# EAGLE design G209B (EAGLE 6.6.0)
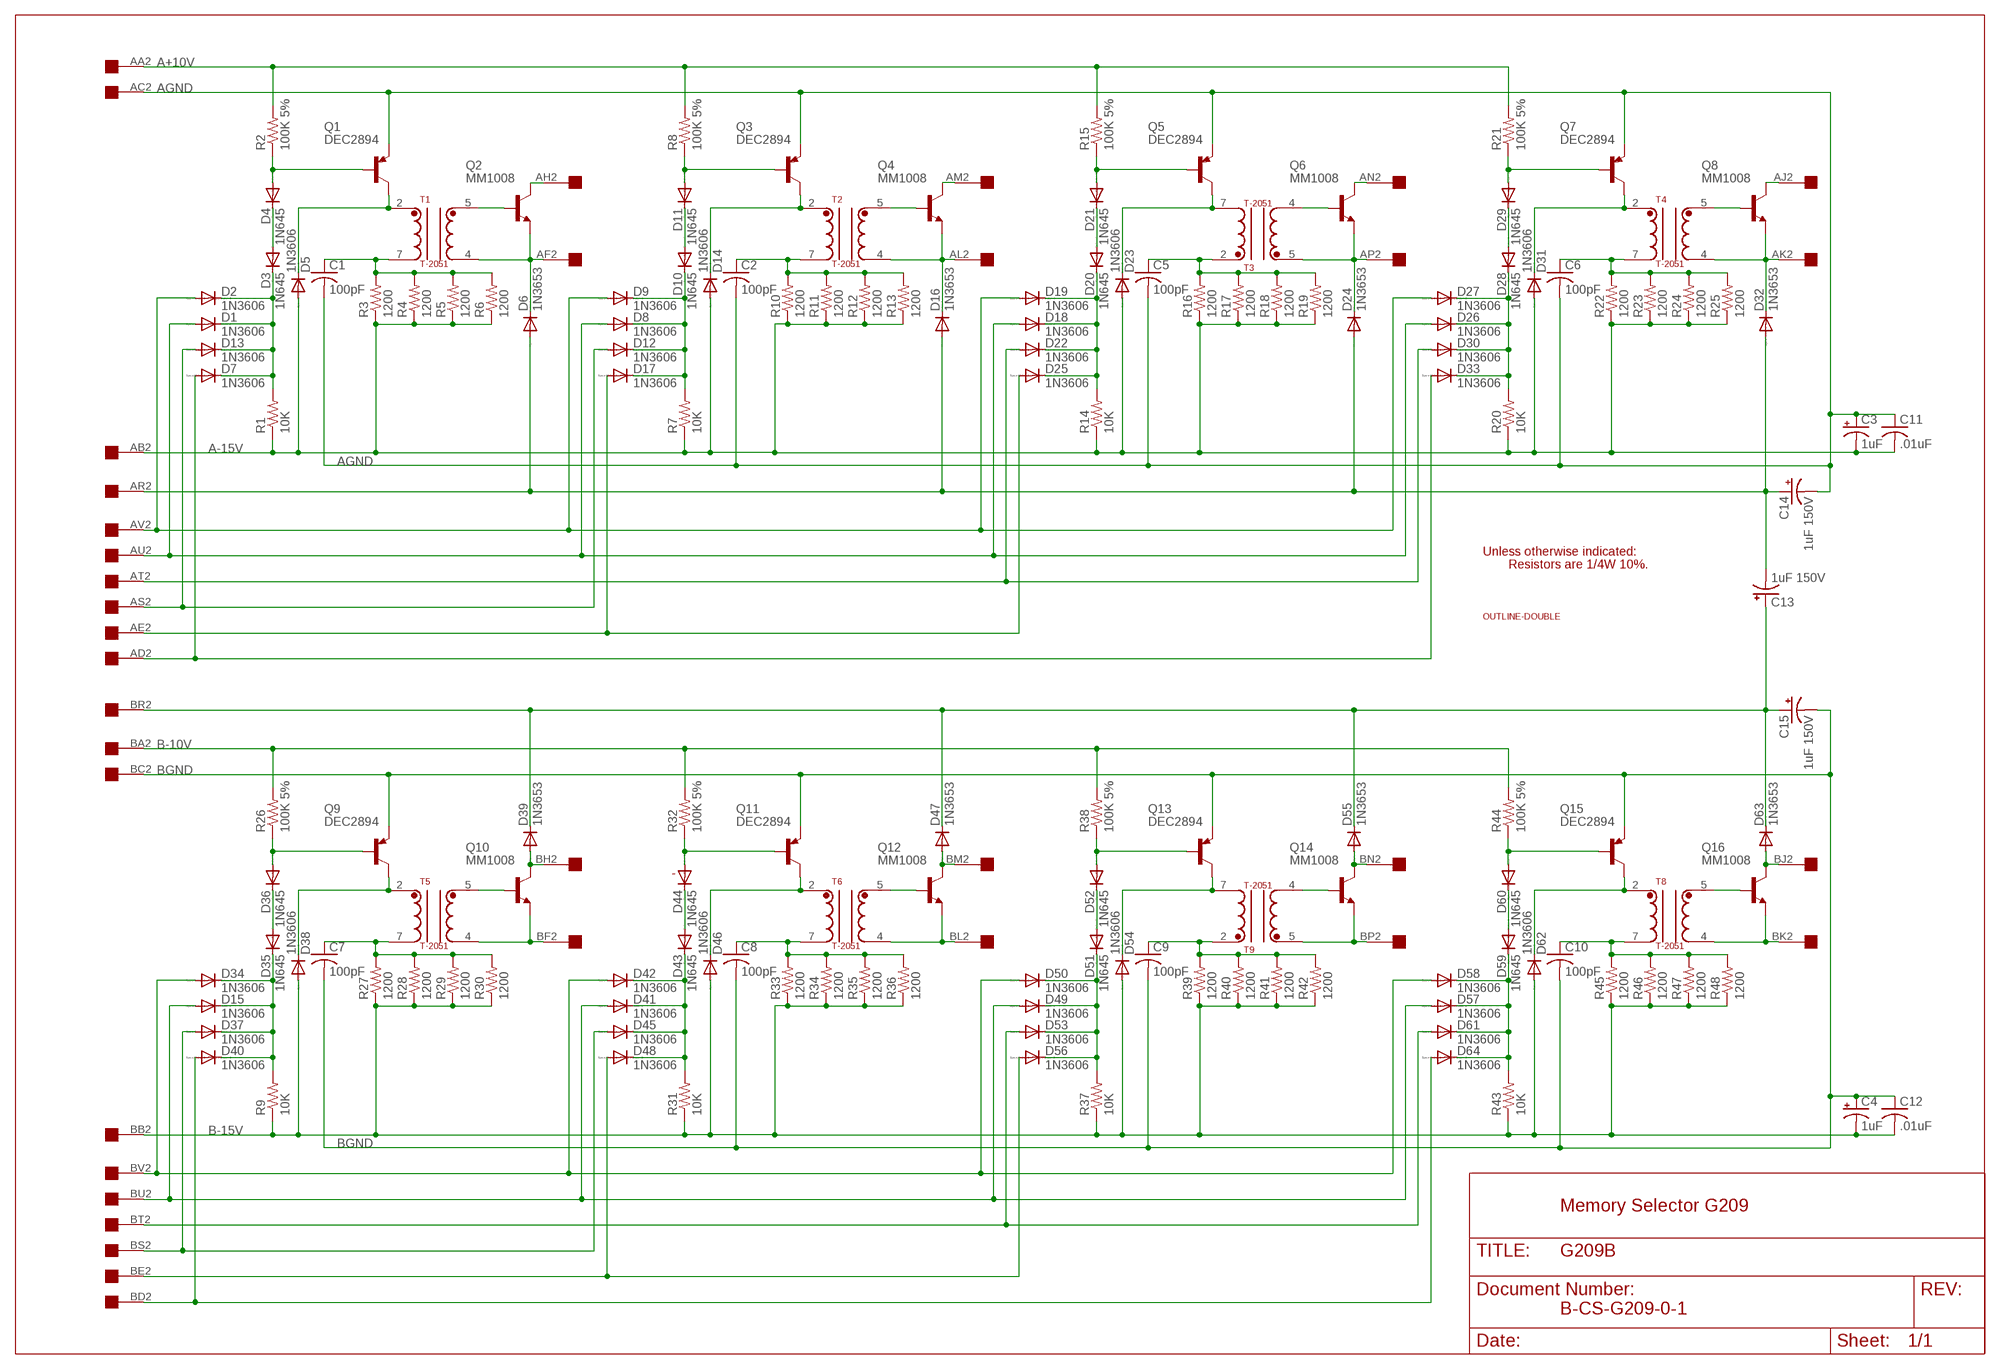
[diagram p0: schematic, sheet 1]

## Parts
C1  100pF  C-US075-032X103  [C075-032X103]
C2  100pF  C-US075-032X103  [C075-032X103]
C3  1uF  CPOL-USE12-4AXIAL  [E12-4]
C4  1uF  CPOL-USE12-4AXIAL  [E12-4]
C5  100pF  C-US075-032X103  [C075-032X103]
C6  100pF  C-US075-032X103  [C075-032X103]
C7  100pF  C-US075-032X103  [C075-032X103]
C8  100pF  C-US075-032X103  [C075-032X103]
C9  100pF  C-US075-032X103  [C075-032X103]
C10  100pF  C-US075-032X103  [C075-032X103]
C11  .01uF  C-US050-025X075  [C050-025X075]
C12  .01uF  C-US050-025X075  [C050-025X075]
C13  1uF 150V  CPOL-USE25-9AXIAL  [E25-9]
C14  1uF 150V  CPOL-USE25-9AXIAL  [E25-9]
C15  1uF 150V  CPOL-USE25-9AXIAL  [E25-9]
D1  1N3606  1N4148DO35-10  [DO35-10]
D2  1N3606  1N4148DO35-10  [DO35-10]
D3  1N645  1N4148DO35-10  [DO35-10]
D4  1N645  1N4148DO35-10  [DO35-10]
D5  1N3606  1N4148DO35-10  [DO35-10]
D6  1N3653  1N4148DO35-10  [DO35-10]
D7  1N3606  1N4148DO35-10  [DO35-10]
D8  1N3606  1N4148DO35-10  [DO35-10]
D9  1N3606  1N4148DO35-10  [DO35-10]
D10  1N645  1N4148DO35-10  [DO35-10]
D11  1N645  1N4148DO35-10  [DO35-10]
D12  1N3606  1N4148DO35-10  [DO35-10]
D13  1N3606  1N4148DO35-10  [DO35-10]
D14  1N3606  1N4148DO35-10  [DO35-10]
D15  1N3606  1N4148DO35-10  [DO35-10]
D16  1N3653  1N4148DO35-10  [DO35-10]
D17  1N3606  1N4148DO35-10  [DO35-10]
D18  1N3606  1N4148DO35-10  [DO35-10]
D19  1N3606  1N4148DO35-10  [DO35-10]
D20  1N645  1N4148DO35-10  [DO35-10]
D21  1N645  1N4148DO35-10  [DO35-10]
D22  1N3606  1N4148DO35-10  [DO35-10]
D23  1N3606  1N4148DO35-10  [DO35-10]
D24  1N3653  1N4148DO35-10  [DO35-10]
D25  1N3606  1N4148DO35-10  [DO35-10]
D26  1N3606  1N4148DO35-10  [DO35-10]
D27  1N3606  1N4148DO35-10  [DO35-10]
D28  1N645  1N4148DO35-10  [DO35-10]
D29  1N645  1N4148DO35-10  [DO35-10]
D30  1N3606  1N4148DO35-10  [DO35-10]
D31  1N3606  1N4148DO35-10  [DO35-10]
D32  1N3653  1N4148DO35-10  [DO35-10]
D33  1N3606  1N4148DO35-10  [DO35-10]
D34  1N3606  1N4148DO35-10  [DO35-10]
D35  1N645  1N4148DO35-10  [DO35-10]
D36  1N645  1N4148DO35-10  [DO35-10]
D37  1N3606  1N4148DO35-10  [DO35-10]
D38  1N3606  1N4148DO35-10  [DO35-10]
D39  1N3653  1N4148DO35-10  [DO35-10]
D40  1N3606  1N4148DO35-10  [DO35-10]
D41  1N3606  1N4148DO35-10  [DO35-10]
D42  1N3606  1N4148DO35-10  [DO35-10]
D43  1N645  1N4148DO35-10  [DO35-10]
D44  1N645  1N4148DO35-10  [DO35-10]
D45  1N3606  1N4148DO35-10  [DO35-10]
D46  1N3606  1N4148DO35-10  [DO35-10]
D47  1N3653  1N4148DO35-10  [DO35-10]
D48  1N3606  1N4148DO35-10  [DO35-10]
D49  1N3606  1N4148DO35-10  [DO35-10]
D50  1N3606  1N4148DO35-10  [DO35-10]
D51  1N645  1N4148DO35-10  [DO35-10]
D52  1N645  1N4148DO35-10  [DO35-10]
D53  1N3606  1N4148DO35-10  [DO35-10]
D54  1N3606  1N4148DO35-10  [DO35-10]
D55  1N3653  1N4148DO35-10  [DO35-10]
D56  1N3606  1N4148DO35-10  [DO35-10]
D57  1N3606  1N4148DO35-10  [DO35-10]
D58  1N3606  1N4148DO35-10  [DO35-10]
D59  1N645  1N4148DO35-10  [DO35-10]
D60  1N645  1N4148DO35-10  [DO35-10]
D61  1N3606  1N4148DO35-10  [DO35-10]
D62  1N3606  1N4148DO35-10  [DO35-10]
D63  1N3653  1N4148DO35-10  [DO35-10]
D64  1N3606  1N4148DO35-10  [DO35-10]
Q1  DEC2894  2N2904  [TO39]
Q2  MM1008  2N2102  [TO5]
Q3  DEC2894  2N2904  [TO39]
Q4  MM1008  2N2102  [TO5]
Q5  DEC2894  2N2904  [TO39]
Q6  MM1008  2N2102  [TO5]
Q7  DEC2894  2N2904  [TO39]
Q8  MM1008  2N2102  [TO5]
Q9  DEC2894  2N2904  [TO39]
Q10  MM1008  2N2102  [TO5]
Q11  DEC2894  2N2904  [TO39]
Q12  MM1008  2N2102  [TO5]
Q13  DEC2894  2N2904  [TO39]
Q14  MM1008  2N2102  [TO5]
Q15  DEC2894  2N2904  [TO39]
Q16  MM1008  2N2102  [TO5]
R1  10K  R-US_0207/10  [0207/10]
R2  100K 5%  R-US_0207/10  [0207/10]
R3  1200  R-US_0207/10  [0207/10]
R4  1200  R-US_0207/10  [0207/10]
R5  1200  R-US_0207/10  [0207/10]
R6  1200  R-US_0207/10  [0207/10]
R7  10K  R-US_0207/10  [0207/10]
R8  100K 5%  R-US_0207/10  [0207/10]
R9  10K  R-US_0207/10  [0207/10]
R10  1200  R-US_0207/10  [0207/10]
R11  1200  R-US_0207/10  [0207/10]
R12  1200  R-US_0207/10  [0207/10]
R13  1200  R-US_0207/10  [0207/10]
R14  10K  R-US_0207/10  [0207/10]
R15  100K 5%  R-US_0207/10  [0207/10]
R16  1200  R-US_0207/10  [0207/10]
R17  1200  R-US_0207/10  [0207/10]
R18  1200  R-US_0207/10  [0207/10]
R19  1200  R-US_0207/10  [0207/10]
R20  10K  R-US_0207/10  [0207/10]
R21  100K 5%  R-US_0207/10  [0207/10]
R22  1200  R-US_0207/10  [0207/10]
R23  1200  R-US_0207/10  [0207/10]
R24  1200  R-US_0207/10  [0207/10]
R25  1200  R-US_0207/10  [0207/10]
R26  100K 5%  R-US_0207/10  [0207/10]
R27  1200  R-US_0207/10  [0207/10]
R28  1200  R-US_0207/10  [0207/10]
R29  1200  R-US_0207/10  [0207/10]
R30  1200  R-US_0207/10  [0207/10]
R31  10K  R-US_0207/10  [0207/10]
R32  100K 5%  R-US_0207/10  [0207/10]
R33  1200  R-US_0207/10  [0207/10]
R34  1200  R-US_0207/10  [0207/10]
R35  1200  R-US_0207/10  [0207/10]
R36  1200  R-US_0207/10  [0207/10]
R37  10K  R-US_0207/10  [0207/10]
R38  100K 5%  R-US_0207/10  [0207/10]
R39  1200  R-US_0207/10  [0207/10]
R40  1200  R-US_0207/10  [0207/10]
R41  1200  R-US_0207/10  [0207/10]
R42  1200  R-US_0207/10  [0207/10]
R43  10K  R-US_0207/10  [0207/10]
R44  100K 5%  R-US_0207/10  [0207/10]
R45  1200  R-US_0207/10  [0207/10]
R46  1200  R-US_0207/10  [0207/10]
R47  1200  R-US_0207/10  [0207/10]
R48  1200  R-US_0207/10  [0207/10]
T1  T-2051  [TRANSFORMER]
T2  T-2051  [TRANSFORMER]
T3  T-2051  [TRANSFORMER]
T4  T-2051  [TRANSFORMER]
T5  T-2051  [TRANSFORMER]
T6  T-2051  [TRANSFORMER]
T8  T-2051  [TRANSFORMER]
T9  T-2051  [TRANSFORMER]
U$1  DOUBLE  [EDGE-CON4]
U$3  OUTLINE-DOUBLE  [DOUBLE]

## Nets
A+10V [Supply]: R2.2 R8.2 R15.2 R21.2 U$1.AA2
A-15V [Supply]: C3.- C11.2 D5.A D14.A D23.A D31.A R1.1 R3.1 R4.1 R5.1 R6.1 R7.1 R10.1 R11.1 R12.1 R13.1 R14.1 R16.1 R17.1 R18.1 R19.1 R20.1 R22.1 R23.1 R24.1 R25.1 U$1.AB2
AGND [Supply]: C1.2 C2.2 C3.+ C5.2 C6.2 C11.1 C14.- Q1.1(E) Q3.1(E) Q5.1(E) Q7.1(E) U$1.AC2
B-10V [Supply]: R26.2 R32.2 R38.2 R44.2 U$1.BA2
B-15V [Supply]: C4.- C12.2 D38.A D46.A D54.A D62.A R9.1 R27.1 R28.1 R29.1 R30.1 R31.1 R33.1 R34.1 R35.1 R36.1 R37.1 R39.1 R40.1 R41.1 R42.1 R43.1 R45.1 R46.1 R47.1 R48.1 U$1.BB2
BGND [Supply]: C4.+ C7.2 C8.2 C9.2 C10.2 C12.1 C15.- Q9.1(E) Q11.1(E) Q13.1(E) Q15.1(E) U$1.BC2
N$1: D1.C D2.C D3.C D7.C D13.C R1.2
N$2: D3.A D4.C
N$3: D7.A D33.A U$1.AD2
N$4: D12.A D13.A U$1.AS2
N$5: D4.A Q1.2(B) R2.1
N$6: D5.C Q1.3(C) T1.2
N$7: C1.1 R3.2 R4.2 R5.2 R6.2 T1.7
N$8: Q2.2(B) T1.5
N$9: D6.C Q2.1(E) T1.4 U$1.AF2
N$10: D1.A D8.A D18.A D26.A U$1.AU2
N$11: D2.A D9.A D19.A D27.A U$1.AV2
N$12: D8.C D9.C D10.C D12.C D17.C R7.2
N$13: D10.A D11.C
N$14: D11.A Q3.2(B) R8.1
N$15: D14.C Q3.3(C) T2.2
N$16: C2.1 R10.2 R11.2 R12.2 R13.2 T2.7
N$17: Q4.2(B) T2.5
N$18: D16.C Q4.1(E) T2.4 U$1.AL2
N$19: D17.A D25.A U$1.AE2
N$20: D22.A D30.A U$1.AT2
N$21: D15.C D34.C D35.C D37.C D40.C R9.2
N$22: D35.A D36.C
N$23: D18.C D19.C D20.C D22.C D25.C R14.2
N$24: D20.A D21.C
N$25: D21.A Q5.2(B) R15.1
N$26: D23.C Q5.3(C) T3.7
N$27: C5.1 R16.2 R17.2 R18.2 R19.2 T3.2
N$28: Q6.2(B) T3.4
N$29: D24.C Q6.1(E) T3.5 U$1.AP2
N$30: D36.A Q9.2(B) R26.1
N$31: D38.C Q9.3(C) T5.2
N$32: C7.1 R27.2 R28.2 R29.2 R30.2 T5.7
N$33: Q10.2(B) T5.5
N$34: D26.C D27.C D28.C D30.C D33.C R20.2
N$35: D28.A D29.C
N$36: D29.A Q7.2(B) R21.1
N$37: D31.C Q7.3(C) T4.2
N$38: C6.1 R22.2 R23.2 R24.2 R25.2 T4.7
N$39: Q8.2(B) T4.5
N$40: D32.C Q8.1(E) T4.4 U$1.AK2
N$41: Q10.1(E) T5.4 U$1.BF2
N$42: D40.A D64.A U$1.BD2
N$43: D37.A D45.A U$1.BS2
N$44: D15.A D41.A D49.A D57.A U$1.BU2
N$45: Q2.3(C) U$1.AH2
N$49: C13.- C14.+ D6.A D16.A D24.A D32.A U$1.AR2
N$50: Q4.3(C) U$1.AM2
N$51: Q6.3(C) U$1.AN2
N$52: Q8.3(C) U$1.AJ2
N$53: D34.A D42.A D50.A D58.A U$1.BV2
N$54: D41.C D42.C D43.C D45.C D48.C R31.2
N$55: D43.A D44.C
N$56: D44.A Q11.2(B) R32.1
N$57: D46.C Q11.3(C) T6.2
N$58: C8.1 R33.2 R34.2 R35.2 R36.2 T6.7
N$59: Q12.2(B) T6.5
N$60: Q12.1(E) T6.4 U$1.BL2
N$61: D48.A D56.A U$1.BE2
N$62: D49.C D50.C D51.C D53.C D56.C R37.2
N$63: D51.A D52.C
N$64: D52.A Q13.2(B) R38.1
N$65: D54.C Q13.3(C) T9.7
N$66: C9.1 R39.2 R40.2 R41.2 R42.2 T9.2
N$67: Q14.2(B) T9.4
N$68: Q14.1(E) T9.5 U$1.BP2
N$69: D57.C D58.C D59.C D61.C D64.C R43.2
N$70: D59.A D60.C
N$71: D60.A Q15.2(B) R44.1
N$72: D62.C Q15.3(C) T8.2
N$73: C10.1 R45.2 R46.2 R47.2 R48.2 T8.7
N$74: Q16.2(B) T8.5
N$75: Q16.1(E) T8.4 U$1.BK2
N$76: D39.A Q10.3(C) U$1.BH2
N$80: C13.+ C15.+ D39.C D47.C D55.C D63.C U$1.BR2
N$81: D47.A Q12.3(C) U$1.BM2
N$82: D55.A Q14.3(C) U$1.BN2
N$83: D63.A Q16.3(C) U$1.BJ2
N$84: D53.A D61.A U$1.BT2
Unconnected: U$1.AA1 U$1.AB1 U$1.AC1 U$1.AD1 U$1.AE1 U$1.AF1 U$1.AH1 U$1.AJ1 U$1.AK1 U$1.AL1 U$1.AM1 U$1.AN1 U$1.AP1 U$1.AR1 U$1.AS1 U$1.AT1 U$1.AU1 U$1.AV1 U$1.BA1 U$1.BB1 U$1.BC1 U$1.BD1 U$1.BE1 U$1.BF1 U$1.BH1 U$1.BJ1 U$1.BK1 U$1.BL1 U$1.BM1 U$1.BN1 U$1.BP1 U$1.BR1 U$1.BS1 U$1.BT1 U$1.BU1 U$1.BV1

## Notes on the sheet
- Unless otherwise indicated:
- Resistors are 1/4W 10%.
- -
- Memory Selector G209
- B-CS-G209-0-1

## Library data of the parts
C1 C2 C5-C12 = rcl:C-US: CAPACITOR, American symbol
C3 C4 = dec-con:CPOL-USE12-4AXIAL: 0.5" veresion of an electrolytic
C13-C15 = rcl:CPOL-US: POLARIZED CAPACITOR, American symbol
D1-D64 = diode:1N4148: DIODE high speed (Philips)
Q1 Q3 Q5 Q7 Q9 Q11 Q13 Q15 = transistor-pnp:2N2904*: PNP Transistror
Q2 Q4 Q6 Q8 Q10 Q12 Q14 Q16 = transistor:2N2102: NPN TRANSISTOR
R1-R48 = rcl:R-US_: RESISTOR, American symbol
T1-T6 T8 T9 = dec-con:T-2051: T-2052 Transformer
U$1 = dec-con:DOUBLE: Double-Height DEC board
U$3 = dec-con:OUTLINE-*: Board outlines for DEC boards.

## Net classes
1 Supply: width 0.813 mm

## Board
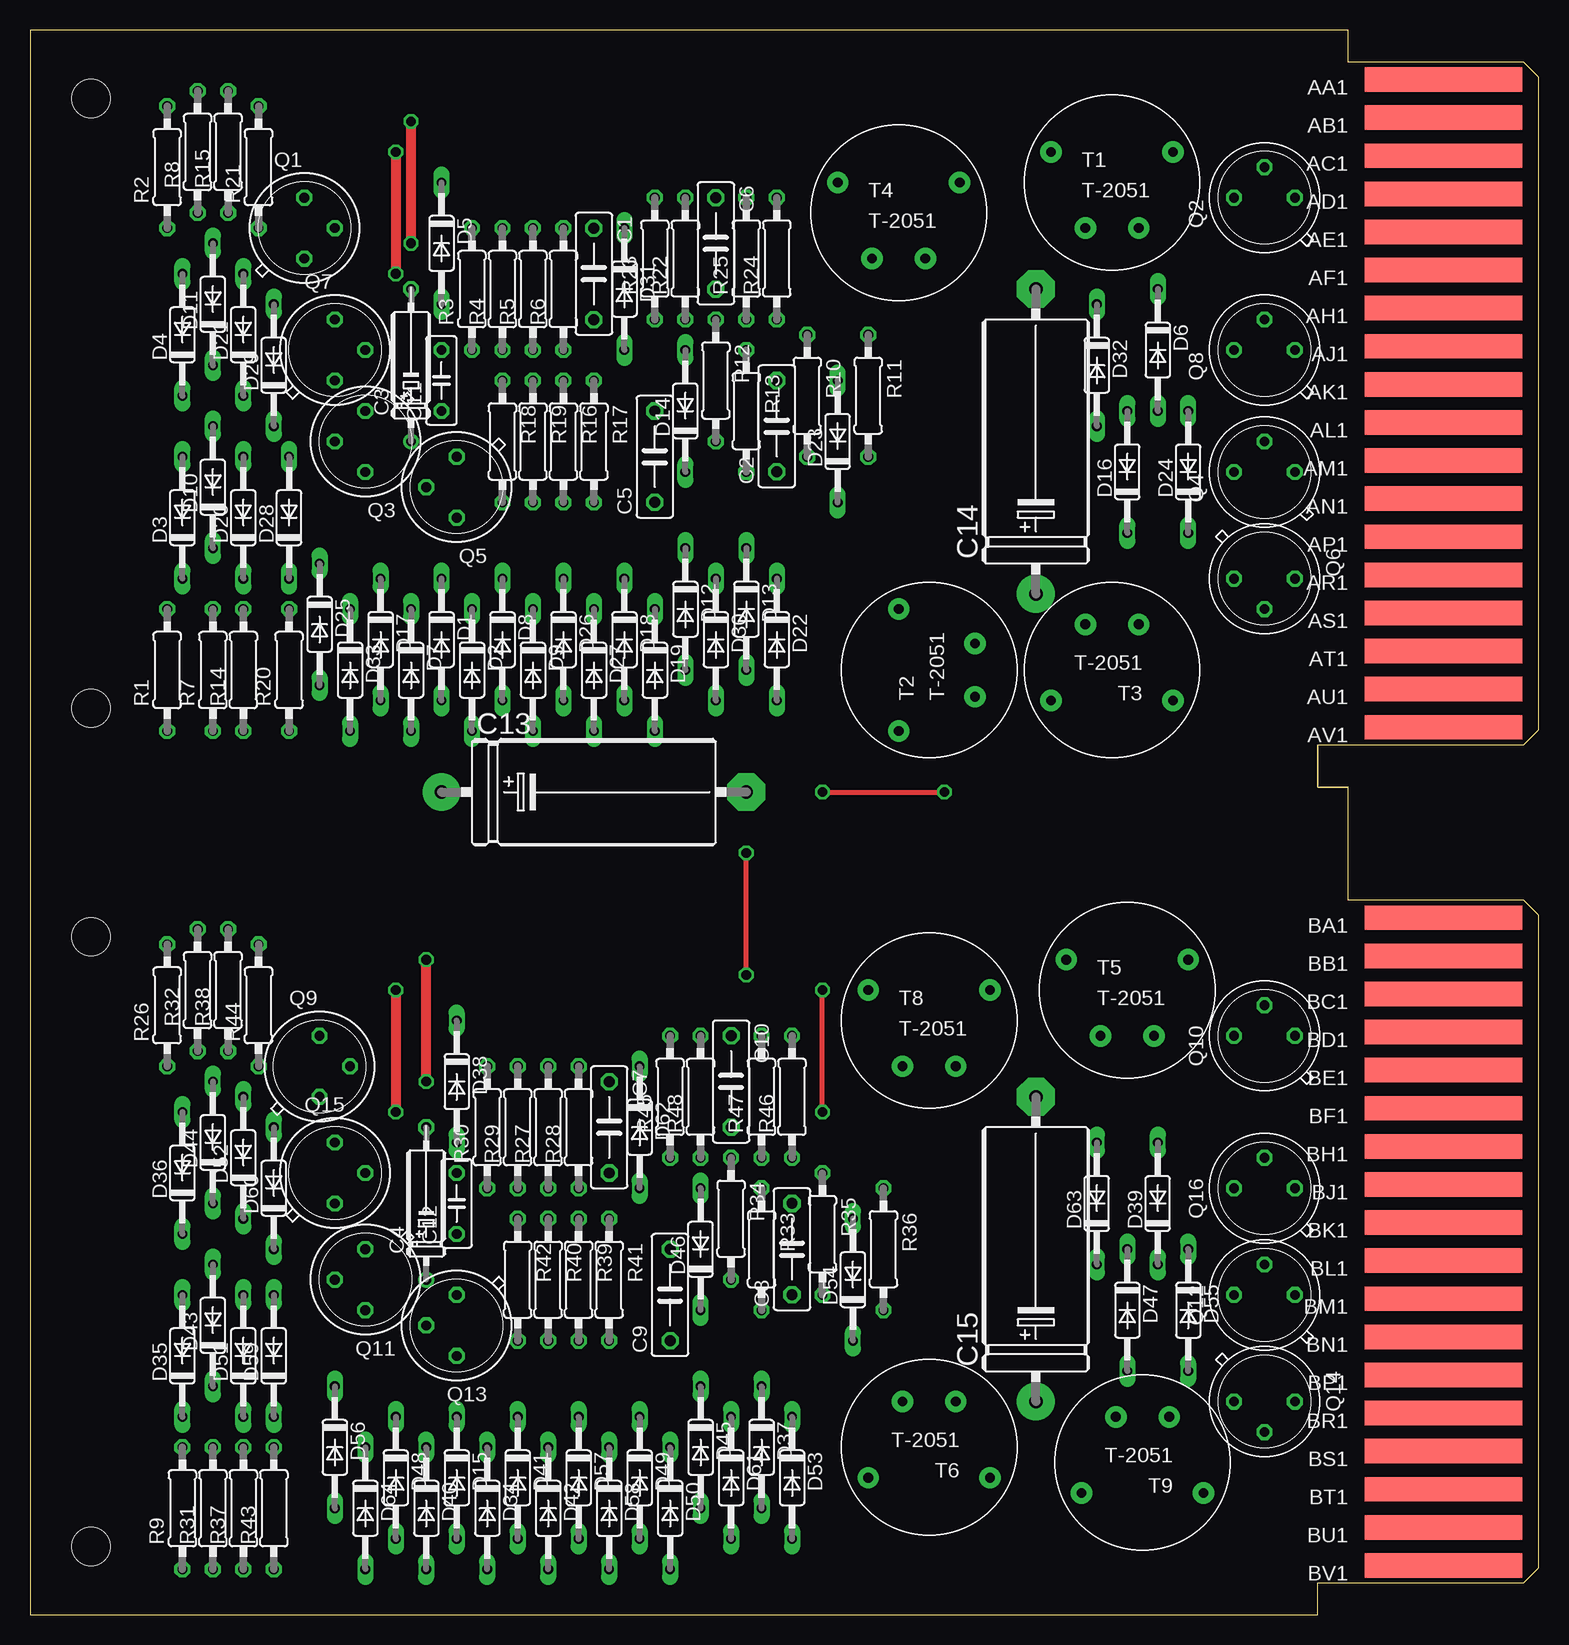
[diagram p1: board, top side]
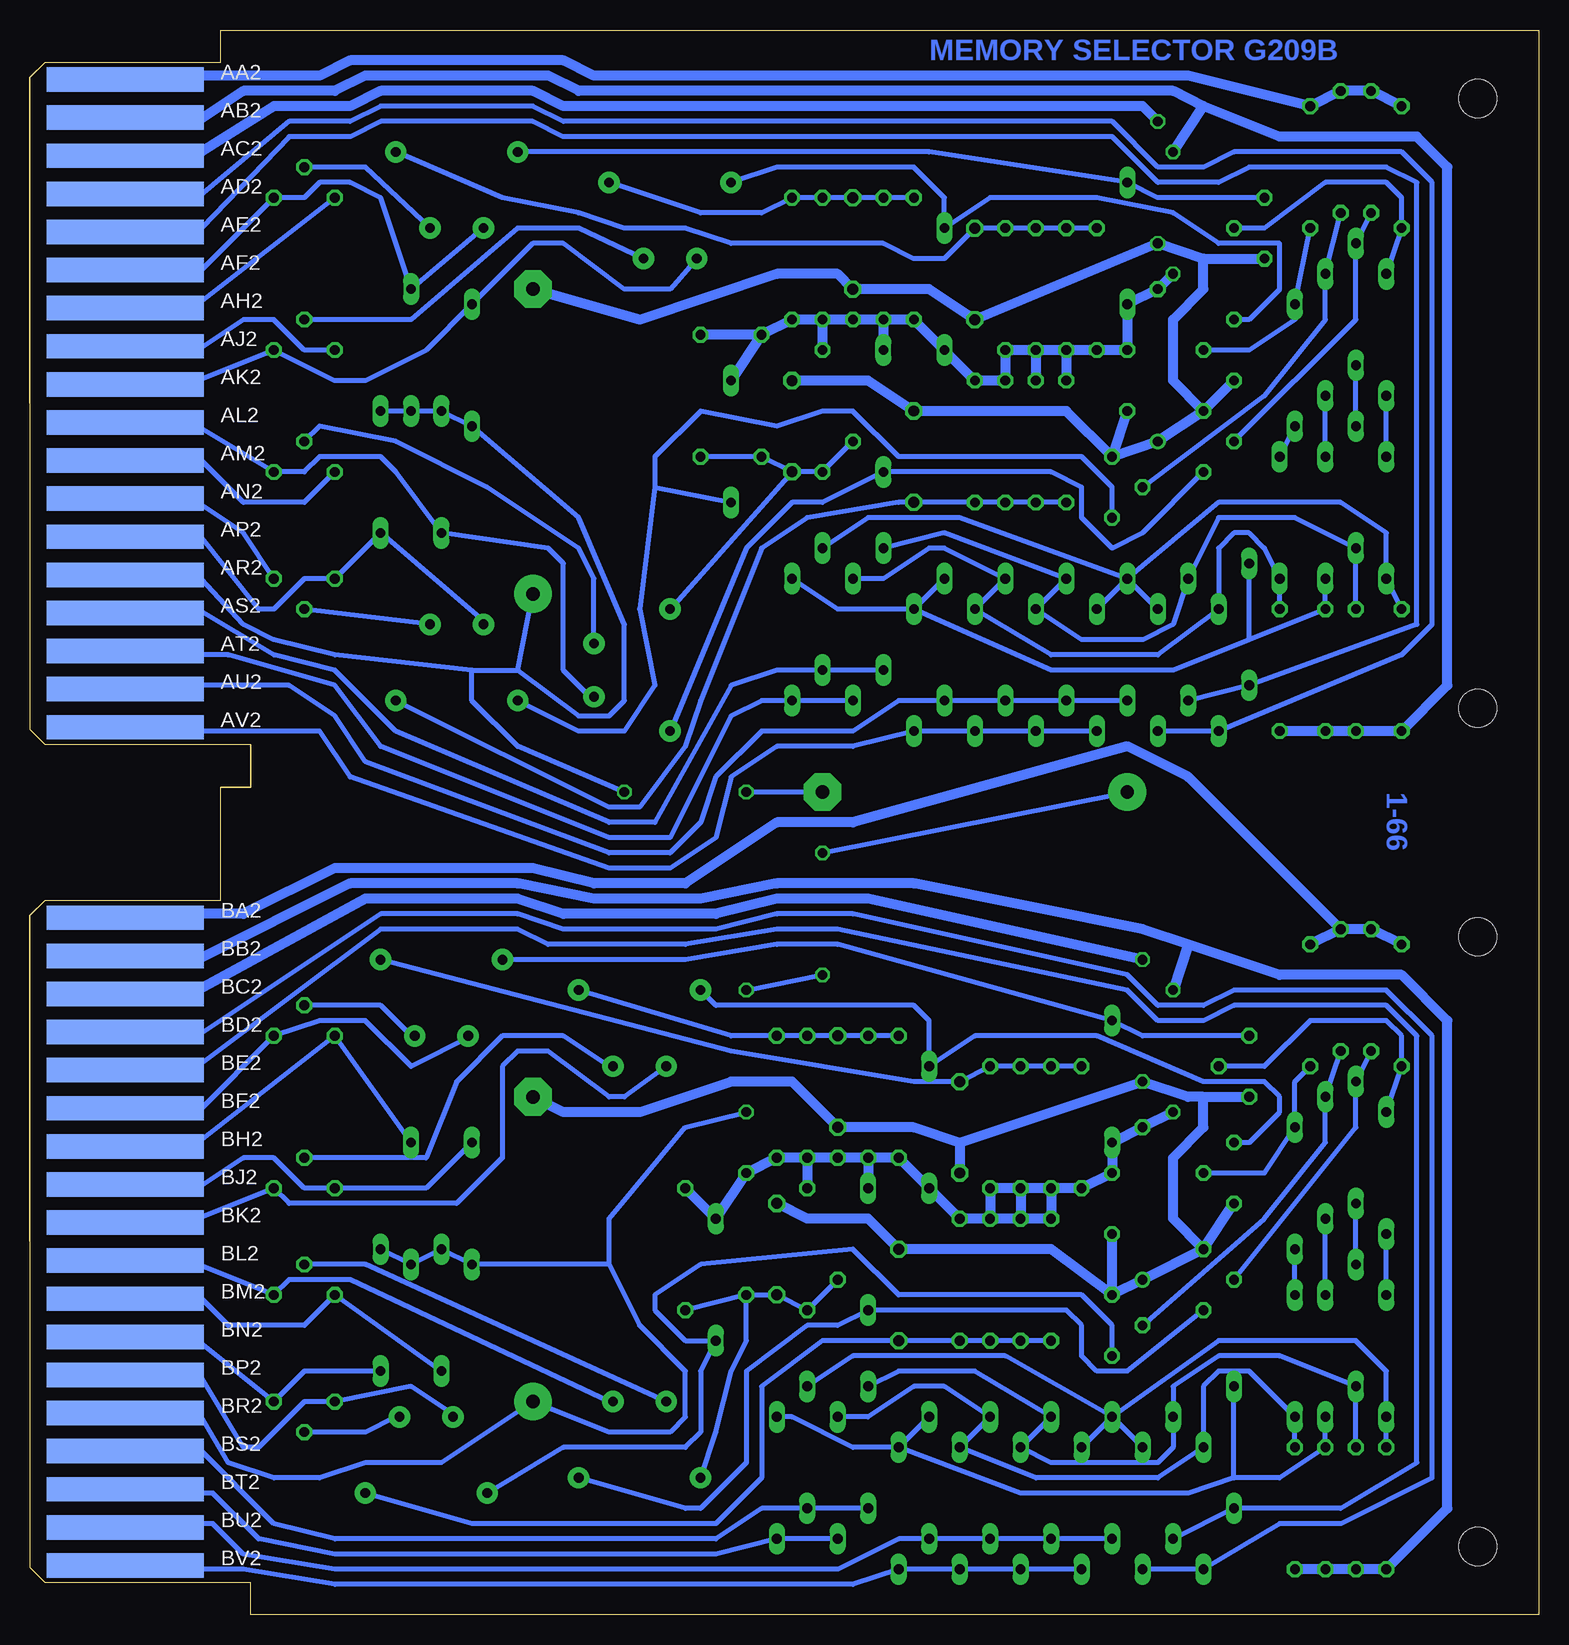
[diagram p2: board, bottom side, seen from below]

Size 125.73 x 132.08 mm. Coordinates in mm from the lower left corner, seen from the top.
Copper layers (1+16): Top 0.035mm / dielectric 1.5mm / Bottom 0.035mm
Design rules "16mils": minimum track width 16mil, minimum drill 32mil, track to track 15mil, track to pad 10mil, pad to pad 10mil, via to via 10mil, smd to smd 10mil, copper to edge 13mil, drill to drill 10mil, minimum pad ring 10mil, minimum via ring 8mil, stop-mask expansion 0mil, vias tented up to drill 0mil, thermal gap 10mil

### Footprints (pad centres in the part's own frame; a part is rotated, then mirrored left to right if it is on the bottom)
C075-032X103 = drill 0.914 octagon: 1 -3.81,0; 2 3.81,0
E12-4 = drill 0.813: + -7.62,0 | drill 0.813 octagon: - 5.08,0
C050-025X075 = drill 0.813 octagon: 1 -2.54,0; 2 2.54,0
E25-9 = drill 1.118 pad 3.15: + -12.7,0 | drill 1.118 pad 3.15 octagon: - 12.7,0
DO35-10 = drill 0.813 long: A 5.08,0; C -5.08,0
TO39 = drill 0.813 octagon: 1 0,-2.54; 2 2.54,0; 3 0,2.54
TO5 = drill 0.813 octagon: 1 0,-2.54; 2 2.54,0; 3 0,2.54
0207/10 = drill 0.813 octagon: 1 -5.08,0; 2 5.08,0
TRANSFORMER = drill 0.813 pad 1.778: 2 -5.08,2.54; 4 -2.223,-3.81; 5 2.223,-3.81; 7 5.08,2.54
EDGE-CON4 = smd 13.106 x 2.032: AA1 7.938,4.128; AB1 7.938,7.303; AC1 7.938,10.477; AD1 7.938,13.652; AE1 7.938,16.828; AF1 7.938,20.003; AH1 7.938,23.177; AJ1 7.938,26.352; AK1 7.938,29.527; AL1 7.938,32.703; AM1 7.938,35.877; AN1 7.938,39.053; AP1 7.938,42.227; AR1 7.938,45.403; AS1 7.938,48.578; AT1 7.938,51.752; AU1 7.938,54.928; AV1 7.938,58.102; BA1 7.938,73.978; BB1 7.938,77.153; BC1 7.938,80.328; BD1 7.938,83.502; BE1 7.938,86.677; BF1 7.938,89.853; BH1 7.938,93.028; BJ1 7.938,96.203; BK1 7.938,99.377; BL1 7.938,102.552; BM1 7.938,105.728; BN1 7.938,108.903; BP1 7.938,112.078; BR1 7.938,115.252; BS1 7.938,118.427; BT1 7.938,121.603; BU1 7.938,124.778; BV1 7.938,127.953 | smd 13.106 x 2.032 bottom: AA2 7.938,4.128; AB2 7.938,7.303; AC2 7.938,10.477; AD2 7.938,13.652; AE2 7.938,16.828; AF2 7.938,20.003; AH2 7.938,23.177; AJ2 7.938,26.352; AK2 7.938,29.527; AL2 7.938,32.703; AM2 7.938,35.877; AN2 7.938,39.053; AP2 7.938,42.227; AR2 7.938,45.403; AS2 7.938,48.578; AT2 7.938,51.752; AU2 7.938,54.928; AV2 7.938,58.102; BA2 7.938,73.978; BB2 7.938,77.153; BC2 7.938,80.328; BD2 7.938,83.502; BE2 7.938,86.677; BF2 7.938,89.853; BH2 7.938,93.028; BJ2 7.938,96.203; BK2 7.938,99.377; BL2 7.938,102.552; BM2 7.938,105.728; BN2 7.938,108.903; BP2 7.938,112.078; BR2 7.938,115.252; BS2 7.938,118.427; BT2 7.938,121.603; BU2 7.938,124.778; BV2 7.938,127.953
DOUBLE = hole 3.175: 120.65,56.515; 120.65,5.715; 120.65,75.565; 120.65,126.365

### Placement (x,y rotation side)
C1  46.99,111.76 270 top
C2  62.23,99.06 90 top
C3  31.75,105.41 90 top
C4  33.02,35.56 90 top
C5  52.07,96.52 90 top
C6  57.15,114.3 270 top
C7  48.26,40.64 270 top
C8  63.5,30.48 90 top
C9  53.34,26.67 90 top
C10  58.42,44.45 270 top
C11  34.29,102.87 90 top
C12  35.56,34.29 90 top
C13  46.99,68.58 0 top
C14  83.82,97.79 90 top
C15  83.82,30.48 90 top
D1  34.29,81.28 270 top
D2  36.83,78.74 270 top
D3  12.7,91.44 90 top
D4  12.7,106.68 90 top
D5  34.29,114.3 270 top
D6  93.98,105.41 270 top
D7  31.75,78.74 270 top
D8  39.37,81.28 270 top
D9  41.91,78.74 270 top
D10  15.24,93.98 90 top
D11  15.24,109.22 90 top
D12  54.61,83.82 270 top
D13  59.69,83.82 270 top
D14  54.61,100.33 90 top
D15  35.56,11.43 270 top
D16  91.44,95.25 90 top
D17  29.21,81.28 270 top
D18  49.53,81.28 270 top
D19  52.07,78.74 270 top
D20  17.78,91.44 90 top
D21  17.78,106.68 90 top
D22  62.23,81.28 270 top
D23  67.31,97.79 90 top
D24  96.52,95.25 90 top
D25  24.13,82.55 270 top
D26  44.45,81.28 270 top
D27  46.99,78.74 270 top
D28  21.59,91.44 90 top
D29  20.32,104.14 90 top
D30  57.15,81.28 270 top
D31  49.53,110.49 270 top
D32  88.9,104.14 270 top
D33  26.67,78.74 270 top
D34  38.1,8.89 270 top
D35  12.7,21.59 90 top
D36  12.7,36.83 90 top
D37  60.96,13.97 270 top
D38  35.56,44.45 270 top
D39  93.98,34.29 90 top
D40  33.02,8.89 270 top
D41  40.64,11.43 270 top
D42  43.18,8.89 270 top
D43  15.24,24.13 90 top
D44  15.24,39.37 90 top
D45  55.88,13.97 270 top
D46  55.88,30.48 90 top
D47  91.44,25.4 270 top
D48  30.48,11.43 270 top
D49  50.8,11.43 270 top
D50  53.34,8.89 270 top
D51  17.78,21.59 90 top
D52  17.78,38.1 90 top
D53  63.5,11.43 270 top
D54  68.58,27.94 90 top
D55  96.52,25.4 270 top
D56  25.4,13.97 270 top
D57  45.72,11.43 270 top
D58  48.26,8.89 270 top
D59  20.32,21.59 90 top
D60  20.32,35.56 90 top
D61  58.42,11.43 270 top
D62  50.8,40.64 270 top
D63  88.9,34.29 90 top
D64  27.94,8.89 270 top
Q1  22.86,115.57 0 top
Q2  102.87,118.11 90 top
Q3  27.94,97.79 180 top
Q4  102.87,95.25 90 top
Q5  35.56,93.98 180 top
Q6  102.87,86.36 270 top
Q7  25.4,105.41 0 top
Q8  102.87,105.41 90 top
Q9  24.13,45.72 0 top
Q10  102.87,48.26 90 top
Q11  27.94,27.94 180 top
Q12  102.87,26.67 90 top
Q13  35.56,24.13 180 top
Q14  102.87,17.78 270 top
Q15  25.4,36.83 0 top
Q16  102.87,35.56 90 top
R1  11.43,78.74 90 top
R2  11.43,120.65 90 top
R3  36.83,110.49 90 top
R4  39.37,110.49 90 top
R5  41.91,110.49 90 top
R6  44.45,110.49 90 top
R7  15.24,78.74 90 top
R8  13.97,121.92 90 top
R9  12.7,8.89 90 top
R10  64.77,101.6 270 top
R11  69.85,101.6 270 top
R12  57.15,102.87 270 top
R13  59.69,100.33 270 top
R14  17.78,78.74 90 top
R15  16.51,121.92 90 top
R16  44.45,97.79 270 top
R17  46.99,97.79 270 top
R18  39.37,97.79 270 top
R19  41.91,97.79 270 top
R20  21.59,78.74 90 top
R21  19.05,120.65 90 top
R22  54.61,113.03 90 top
R23  52.07,113.03 90 top
R24  62.23,113.03 90 top
R25  59.69,113.03 90 top
R26  11.43,50.8 90 top
R27  43.18,40.64 90 top
R28  45.72,40.64 90 top
R29  40.64,40.64 90 top
R30  38.1,40.64 90 top
R31  15.24,8.89 90 top
R32  13.97,52.07 90 top
R33  60.96,30.48 270 top
R34  58.42,33.02 270 top
R35  66.04,31.75 270 top
R36  71.12,30.48 270 top
R37  17.78,8.89 90 top
R38  16.51,52.07 90 top
R39  45.72,27.94 270 top
R40  43.18,27.94 270 top
R41  48.26,27.94 270 top
R42  40.64,27.94 270 top
R43  20.32,8.89 90 top
R44  19.05,50.8 90 top
R45  53.34,43.18 90 top
R46  63.5,43.18 90 top
R47  60.96,43.18 90 top
R48  55.88,43.18 90 top
T1  90.17,119.38 0 top
T2  74.93,78.74 90 top
T3  90.17,78.74 180 top
T4  72.39,116.84 0 top
T5  91.44,52.07 0 top
T6  74.93,13.97 180 top
T8  74.93,49.53 0 top
T9  92.71,12.7 180 top
U$1  125.73,132.08 180 top
U$3  125.73,132.08 180 top

### Tracks (layer width: path | path; a pad name or v marks a point on that pad's centre or on a via)
A+10V
  Bottom 0.813: U$1.AA2 117.24,127.87 116.84,128.27 101.6,128.27 99.06,129.54 81.28,129.54 78.74,128.27 29.21,128.27 R21.2 R15.2 R8.2 R2.2
A-15V  (via drill 0.81)
  Top 0.813: v30.48,121.92 v30.48,111.76
  Bottom 0.813: U$1.AB2 116.84,124.46 111.76,124.46 107.95,127 100.33,127 97.79,128.27 82.55,128.27 80.01,127 30.48,127 27.94,125.73 | 27.94,125.73 v30.48,121.92 | R20.1 R14.1 R7.1 R1.1 7.62,77.47 7.62,120.65 10.16,123.19 21.59,123.19 27.94,125.73 | R4.1 R3.1 C11.2 D5.A C3.- v30.48,111.76 | R4.1 R18.1 | R4.1 R5.1 | R5.1 R19.1 | R5.1 R6.1 R16.1 R17.1 D31.A R23.1 R22.1 | R22.1 D14.A | R22.1 R12.1 R25.1 | R25.1 R13.1 | R25.1 R24.1 R10.1 | R10.1 D23.A | R10.1 R11.1
AGND  (via drill 0.81)
  Top 0.813: v31.75,114.3 v31.75,124.46
  Bottom 0.813: U$1.AC2 116.84,121.92 111.44,121.92 105.41,125.73 99.06,125.73 96.52,127 83.82,127 81.28,125.73 33.02,125.73 v31.75,124.46 | C2.2 55.88,102.87 C5.2 39.37,100.33 Q5.1 | 27.94,113.03 Q1.1 | 27.94,113.03 v31.75,114.3 C1.2 50.8,110.49 C6.2 58.42,111.76 63.5,111.76 74.93,107.95 C14.- | Q3.1 Q7.1 | Q3.1 30.48,102.87 30.48,107.95 27.94,110.49 27.94,113.03 | Q3.1 C3.+ Q5.1 | Q5.1 C11.1
B-10V
  Bottom 0.813: U$1.BA2 116.84,58.42 107.95,58.42 100.33,62.23 83.82,62.23 78.74,60.96 71.12,60.96 63.5,66.04 57.15,66.04 34.29,72.39 29.21,69.85 R38.2 | R26.2 R32.2 R38.2 | R38.2 R44.2
B-15V  (via drill 0.81)
  Top 0.813: v30.48,52.07 v30.48,41.91
  Bottom 0.813: U$1.BB2 116.84,54.61 111.76,54.61 99.06,60.96 85.09,60.96 78.74,59.69 69.85,59.69 63.5,60.96 52.07,60.96 33.02,57.15 29.21,55.88 | 29.21,55.88 v30.48,52.07 | v30.48,41.91 C4.- D38.A C12.2 R30.1 R29.1 | R29.1 R27.1 | R27.1 R28.1 R39.1 | R39.1 R41.1 D62.A R45.1 R48.1 | R40.1 R39.1 | R40.1 R42.1 R29.1 | R27.1 R40.1 | R48.1 D46.A | R48.1 R34.1 R47.1 | R47.1 R33.1 | R47.1 R46.1 R35.1 D54.A R36.1 | 29.21,55.88 21.59,53.34 11.43,53.34 7.62,49.53 7.62,8.89 R9.1 R31.1 R37.1 R43.1
BGND  (via drill 0.81)
  Top 0.813: v33.02,44.45 v33.02,54.61
  Bottom 0.813: U$1.BC2 115.57,52.07 111.76,52.07 97.79,59.69 85.09,59.69 81.28,58.42 68.58,58.42 63.5,59.69 55.88,59.69 v33.02,54.61 | 27.94,43.18 Q9.1 | 27.94,43.18 29.21,43.18 v33.02,44.45 48.26,39.37 | Q15.1 Q11.1 | Q11.1 30.48,33.02 30.48,38.1 27.94,40.64 27.94,43.18 | Q13.1 C4.+ Q11.1 | Q13.1 C12.1 | Q13.1 40.64,30.48 C9.2 55.88,33.02 60.96,33.02 C8.2 | 48.26,39.37 C7.2 | 48.26,39.37 52.07,40.64 C10.2 62.23,44.45 67.31,44.45 74.93,41.91 81.28,41.91 C15.-
N$1
  Bottom 0.406: R1.2 D3.C 12.7,90.17 16.51,92.71 26.67,92.71 D1.C | D1.C D2.C | D13.C 55.88,91.44 48.26,91.44 D1.C | D1.C D7.C
N$2
  Bottom 0.406: D3.A D4.C
N$3
  Bottom 0.406: U$1.AD2 116.84,118.11 111.76,118.11 104.14,124.46 99.06,124.46 96.52,125.73 83.82,125.73 81.28,124.46 35.56,124.46 31.75,120.65 27.94,120.65 25.4,121.92 11.43,121.92 8.89,119.38 8.89,82.55 11.43,80.01 D33.A D7.A
N$4
  Bottom 0.406: U$1.AS2 116.84,83.82 111.76,83.82 105.41,80.01 100.33,78.74 95.25,73.66 77.47,66.04 73.66,66.04 67.31,77.47 63.5,78.74 D13.A D12.A
N$5
  Bottom 0.406: D4.A R2.1 11.43,118.11 12.7,119.38 17.78,119.38 22.86,115.57 Q1.2
N$6
  Bottom 0.406: T1.2 50.8,121.92 D5.C 31.75,118.11 Q1.3
N$7
  Bottom 0.406: R3.2 R4.2 R5.2 R6.2 C1.1 49.53,113.03 52.07,113.03 54.61,114.3 67.31,114.3 71.12,115.57 76.2,115.57 80.01,116.84 86.36,118.11 T1.7
N$8
  Bottom 0.406: T1.5 97.79,120.65 Q2.2
N$9
  Bottom 0.406: U$1.AF2 116.84,111.76 111.76,111.76 Q2.1 102.87,118.11 101.6,119.38 99.06,119.38 96.52,118.11 D6.C T1.4
N$10
  Bottom 0.406: U$1.AU2 116.84,77.47 104.14,77.47 100.33,74.93 97.79,71.12 77.47,63.5 72.39,63.5 69.85,66.04 68.58,69.85 64.77,73.66 57.15,73.66 53.34,76.2 D18.A D26.A D8.A D1.A
N$11
  Bottom 0.406: U$1.AV2 116.84,73.66 101.6,73.66 99.06,69.85 77.47,62.23 72.39,62.23 68.58,64.77 67.31,69.85 63.5,72.39 57.15,72.39 D19.A D27.A D9.A D2.A
N$12
  Bottom 0.406: D12.C 49.53,90.17 D8.C D9.C 38.1,81.28 33.02,81.28 30.48,82.55 D17.C 26.67,91.44 20.32,91.44 D10.C R7.2
N$13
  Bottom 0.406: D10.A D11.C
N$14
  Bottom 0.406: R8.1 D11.A 15.24,107.95 Q3.2
N$15
  Bottom 0.406: Q3.3 33.02,90.17 35.56,88.9 38.1,91.44 38.1,93.98 40.64,95.25 D14.C 59.69,92.71 62.23,92.71 66.04,88.9 T2.2
N$16
  Bottom 0.406: R12.2 R13.2 C2.1 | C2.1 R10.2 R11.2 | C2.1 T2.7
N$17
  Bottom 0.406: Q4.2 101.6,99.06 95.25,97.79 87.63,93.98 80.01,88.9 78.74,86.36 T2.5
N$18
  Bottom 0.406: U$1.AL2 116.84,99.06 111.76,99.06 Q4.1 102.87,95.25 101.6,96.52 96.52,96.52 95.25,95.25 D16.C 82.55,88.9 81.28,87.63 81.28,78.74 78.74,76.2 T2.4
N$19
  Bottom 0.406: U$1.AE2 116.84,115.57 111.44,115.57 104.14,123.19 99.06,123.19 96.52,124.46 83.82,124.46 81.28,123.19 35.56,123.19 31.75,119.38 26.67,119.38 24.13,120.65 12.7,120.65 10.16,119.38 10.16,82.55 D25.A D17.A
N$20
  Bottom 0.406: U$1.AT2 115.57,80.01 109.22,80.01 100.33,77.47 96.52,72.39 77.47,64.77 72.39,64.77 67.31,74.93 64.77,76.2 D22.A D30.A
N$21
  Bottom 0.406: R9.2 D35.C 12.7,20.32 15.24,22.86 26.67,22.86 D15.C | D15.C D40.C | D15.C D34.C | D15.C 44.45,21.59 57.15,21.59 D37.C
N$22
  Bottom 0.406: D35.A D36.C
N$23
  Bottom 0.406: D20.C R14.2 24.13,81.28 | 24.13,81.28 D25.C | 24.13,81.28 30.48,78.74 40.64,78.74 D19.C | D19.C D18.C | D19.C 58.42,83.82 D22.C
N$24
  Bottom 0.406: D20.A D21.C
N$25
  Bottom 0.406: Q5.2 22.86,101.6 17.78,107.95 D21.A R15.1
N$26
  Bottom 0.406: T3.7 80.01,73.66 76.2,73.66 73.66,77.47 74.93,83.82 73.66,93.98 | 73.66,93.98 D23.C | 73.66,93.98 73.66,96.52 69.85,100.33 63.5,99.06 59.69,100.33 57.15,100.33 53.34,96.52 38.1,96.52 35.56,93.98 Q5.3
N$27
  Bottom 0.406: R18.2 R19.2 R16.2 R17.2 C5.1 53.34,92.71 60.96,91.44 64.77,88.9 69.85,76.2 71.12,72.39 74.93,67.31 77.47,67.31 T3.2
N$28
  Bottom 0.406: T3.4 Q6.2
N$29
  Bottom 0.406: U$1.AP2 116.84,90.17 111.76,90.17 106.68,83.82 105.41,83.82 102.87,86.36 Q6.1 D24.C 87.63,82.55 T3.5
N$30
  Bottom 0.406: Q9.2 22.86,45.72 19.05,49.53 12.7,49.53 11.43,48.26 R26.1 D36.A
N$31
  Bottom 0.406: Q9.3 33.02,48.26 D38.C 58.42,55.88 63.5,55.88 71.12,54.61 T5.2
N$32
  Bottom 0.406: R30.2 R29.2 R27.2 R28.2 C7.1 52.07,44.45 67.31,46.99 T5.7
N$33
  Bottom 0.406: Q10.2 96.52,50.8 93.98,48.26 T5.5
N$34
  Bottom 0.406: R20.2 D28.C 22.86,88.9 24.13,90.17 25.4,90.17 26.67,88.9 D33.C 31.75,80.01 40.64,80.01 D27.C D26.C 49.53,88.9 50.8,88.9 54.61,86.36 D30.C
N$35
  Bottom 0.406: D28.A D29.C
N$36
  Bottom 0.406: R21.1 D29.A 20.32,107.95 24.13,105.41 Q7.2
N$37
  Bottom 0.406: T4.2 63.5,120.65 52.07,120.65 49.53,118.11 D31.C 45.72,118.11 36.83,118.11 30.48,116.84 26.67,114.3 21.59,114.3 21.59,110.49 24.13,107.95 Q7.3
N$38
  Bottom 0.406: R23.2 R22.2 C6.1 R25.2 R24.2 64.77,116.84 69.85,116.84 T4.7
N$39
  Bottom 0.406: T4.5 80.01,115.57 85.09,115.57 93.98,107.95 Q8.2
N$40
  Bottom 0.406: U$1.AK2 116.84,102.87 111.76,102.87 Q8.1 100.33,102.87 97.79,102.87 92.71,105.41 D32.C 83.82,114.3 81.28,114.3 76.2,110.49 72.39,110.49 T4.4
N$41
  Bottom 0.406: U$1.BF2 115.57,41.91 111.76,41.91 Q10.1 101.6,49.53 97.79,49.53 93.98,45.72 88.9,48.26 T5.4
N$42
  Bottom 0.406: U$1.BD2 116.84,48.26 111.76,48.26 96.52,58.42 85.09,58.42 81.28,57.15 68.58,57.15 63.5,58.42 57.15,58.42 34.29,53.34 31.75,50.8 27.94,50.8 25.4,52.07 12.7,52.07 8.89,48.26 8.89,11.43 16.51,7.62 21.59,7.62 D64.A D40.A
N$43
  Bottom 0.406: U$1.BS2 117.14,13.66 116.84,13.97 111.76,13.97 105.41,7.62 100.33,6.35 68.58,6.35 64.77,8.89 D37.A D45.A
N$44
  Bottom 0.406: U$1.BU2 117.2,7.26 116.84,7.62 110.49,7.62 107.95,5.08 100.33,3.81 58.42,3.81 53.34,6.35 D49.A D57.A D41.A D15.A
N$45
  Bottom 0.406: U$1.AH2 116.84,109.22 111.76,109.22 Q2.3
N$49  (via drill 0.81)
  Top 0.406: v66.04,68.58 v76.2,68.58
  Bottom 0.406: U$1.AR2 116.84,86.36 111.44,86.36 107.95,82.55 105.41,81.28 100.33,80.01 88.9,78.74 | 88.9,78.74 85.09,78.74 | 85.09,78.74 C14.+ | 85.09,78.74 80.01,74.93 77.47,74.93 76.2,76.2 76.2,82.55 80.01,91.44 D32.A D16.A D6.A D24.A | 88.9,78.74 88.9,76.2 85.09,72.39 v76.2,68.58 | C13.- v66.04,68.58
N$50
  Bottom 0.406: U$1.AM2 116.84,96.52 111.76,96.52 107.95,92.71 102.87,92.71 Q4.3
N$51
  Bottom 0.406: U$1.AN2 116.84,92.71 111.76,92.71 107.95,90.17 Q6.3
N$52
  Bottom 0.406: U$1.AJ2 115.57,105.41 111.76,105.41 107.95,107.95 105.41,107.95 102.87,105.41 Q8.3
N$53
  Bottom 0.406: U$1.BV2 116.84,3.81 107.95,3.81 100.33,2.54 57.15,2.54 D50.A D58.A D42.A D34.A
N$54
  Bottom 0.406: R31.2 D43.C 21.59,21.59 26.67,21.59 30.48,19.05 D48.C 30.48,13.97 31.75,12.7 40.64,12.7 D42.C D41.C 46.99,20.32 53.34,20.32 D45.C
N$55
  Bottom 0.406: D43.A D44.C
N$56
  Bottom 0.406: Q11.2 15.24,40.64 D44.A R32.1
N$57
  Bottom 0.406: Q11.3 34.29,20.32 36.83,20.32 38.1,21.59 38.1,24.13 39.37,25.4 D46.C 58.42,24.13 60.96,24.13 66.04,20.32 66.04,12.7 69.85,8.89 71.12,8.89 T6.2
N$58
  Bottom 0.406: R34.2 R33.2 C8.1 R35.2 | R35.2 R36.2 | T6.7 68.58,15.24 67.31,20.32 66.04,22.86 R35.2
N$59
  Bottom 0.406: T6.5 97.79,29.21 Q12.2
N$60
  Bottom 0.406: U$1.BL2 116.84,29.21 111.76,29.21 Q12.1 104.14,27.94 99.06,27.94 77.47,17.78 T6.4
N$61
  Bottom 0.406: U$1.BE2 111.76,45.72 96.52,57.15 85.09,57.15 82.55,55.88 71.12,55.88 63.5,57.15 58.42,57.15 34.29,52.07 31.75,49.53 27.94,49.53 25.4,50.8 12.7,50.8 10.16,48.26 10.16,12.7 16.51,8.89 D56.A D48.A
N$62
  Bottom 0.406: D51.C R37.2 21.59,11.43 25.4,11.43 | 25.4,11.43 D56.C | 25.4,11.43 29.21,10.16 43.18,10.16 D50.C | D50.C D49.C | D50.C 57.15,13.97 62.23,16.51 D53.C
N$63
  Bottom 0.406: D51.A D52.C
N$64
  Bottom 0.406: Q13.2 22.86,33.02 17.78,39.37 D52.A R38.1
N$65
  Bottom 0.406: Q13.3 35.56,24.13 38.1,26.67 53.34,26.67 57.15,30.48 69.85,29.21 73.66,26.67 73.66,25.4 71.12,22.86 D54.C 69.85,20.32 69.85,15.24 71.12,13.97 81.28,13.97 T9.7
N$66
  Bottom 0.406: R42.2 R40.2 R39.2 R41.2 C9.1 59.69,22.86 64.77,19.05 64.77,11.43 68.58,7.62 88.9,7.62 T9.2
N$67
  Bottom 0.406: Q14.2 97.79,15.24 95.25,16.51 T9.4
N$68
  Bottom 0.406: U$1.BP2 116.84,20.32 111.76,20.32 107.95,13.97 106.68,13.97 102.87,17.78 Q14.1 93.98,19.05 90.17,16.51 T9.5
N$69
  Bottom 0.406: R43.2 D59.C 24.13,20.32 26.67,20.32 27.94,19.05 D64.C 31.75,11.43 41.91,11.43 D58.C D57.C 49.53,19.05 52.07,19.05 55.88,16.51 D61.C
N$70
  Bottom 0.406: D59.A D60.C
N$71
  Bottom 0.406: Q15.2 22.86,36.83 D60.A 20.32,44.45 R44.1
N$72
  Bottom 0.406: T8.2 68.58,50.8 52.07,50.8 50.8,49.53 D62.C 46.99,48.26 36.83,48.26 27.94,44.45 22.86,44.45 21.59,43.18 21.59,41.91 24.13,39.37 Q15.3
N$73
  Bottom 0.406: R45.2 R48.2 C10.1 R47.2 R46.2 67.31,48.26 T8.7
N$74
  Bottom 0.406: Q16.2 92.71,38.1 90.17,44.45 86.36,48.26 81.28,48.26 77.47,45.72 T8.5
N$75
  Bottom 0.406: T8.4 76.2,43.18 77.47,43.18 82.55,46.99 85.09,46.99 86.36,45.72 86.36,38.1 90.17,34.29 104.14,34.29 Q16.1 111.76,33.02 116.84,33.02 U$1.BK2
N$76
  Bottom 0.406: U$1.BH2 116.84,39.37 111.76,39.37 Q10.3 D39.A
N$80  (via drill 0.81)
  Top 0.406: v59.69,53.34 v59.69,63.5 | v66.04,41.91 v66.04,52.07
  Bottom 0.406: v59.69,63.5 C13.+ | v66.04,52.07 v59.69,53.34 | v66.04,41.91 71.12,40.64 77.47,33.02 77.47,29.21 | 77.47,29.21 D63.C D47.C D39.C D55.C | 77.47,29.21 74.93,24.13 71.12,20.32 71.12,16.51 72.39,15.24 77.47,15.24 C15.+ 91.44,12.7 97.79,12.7 101.6,11.43 105.41,11.43 109.22,12.7 111.44,16.51 116.84,16.51 U$1.BR2
N$81
  Bottom 0.406: U$1.BM2 116.84,26.67 111.76,26.67 109.22,24.13 102.87,24.13 Q12.3 D47.A
N$82
  Bottom 0.406: D55.A 102.87,20.32 Q14.3 111.76,22.86 116.84,22.86 U$1.BN2
N$83
  Bottom 0.406: U$1.BJ2 116.84,35.56 111.76,35.56 107.95,38.1 105.41,38.1 102.87,35.56 Q16.3 92.71,35.56 D63.A
N$84
  Bottom 0.406: U$1.BT2 117.17,10.49 116.84,10.16 110.49,10.16 106.68,6.35 100.33,5.08 68.58,5.08 D53.A D61.A

### Text on the board
Bottom: MEMORY SELECTOR G209B | 1-66